# Altium project roach2_project.PrjPCB (part 10 of 13)

## Sheet mgt_breakout.SchDoc: MGT Mezzanine Card Interfaces
size A3; Date: DO NOT USE, RATHER USE PROJ OPTIONS; DrawnBy: DO NOT USE, RATHER USE PROJ OPTIONS; Engineer: DO NOT USE, RATHER USE PROJ OPTIONS; Organization: DO NOT USE, RATHER USE PROJ OPTIONS; DocumentNumber: DO NOT USE, RATHER USE PROJ OPTIONS; Revision: DO NOT USE, RATHER USE PROJ OPTIONS; SheetNumber: 24; SheetTotal: 27; SCH_Sheet_Filename: mgt_breakout.SchDoc; CurrentTime: DO NOT USE, RATHER USE PROJ OPTIONS; Time: DO NOT USE, RATHER USE PROJ OPTIONS; DocumentFullPathAndName: DO NOT USE, RATHER USE PROJ OPTIONS; DocumentName: DO NOT USE, RATHER USE PROJ OPTIONS; ModifiedDate: DO NOT USE, RATHER USE PROJ OPTIONS; ImagePath: DO NOT USE, RATHER USE PROJ OPTIONS
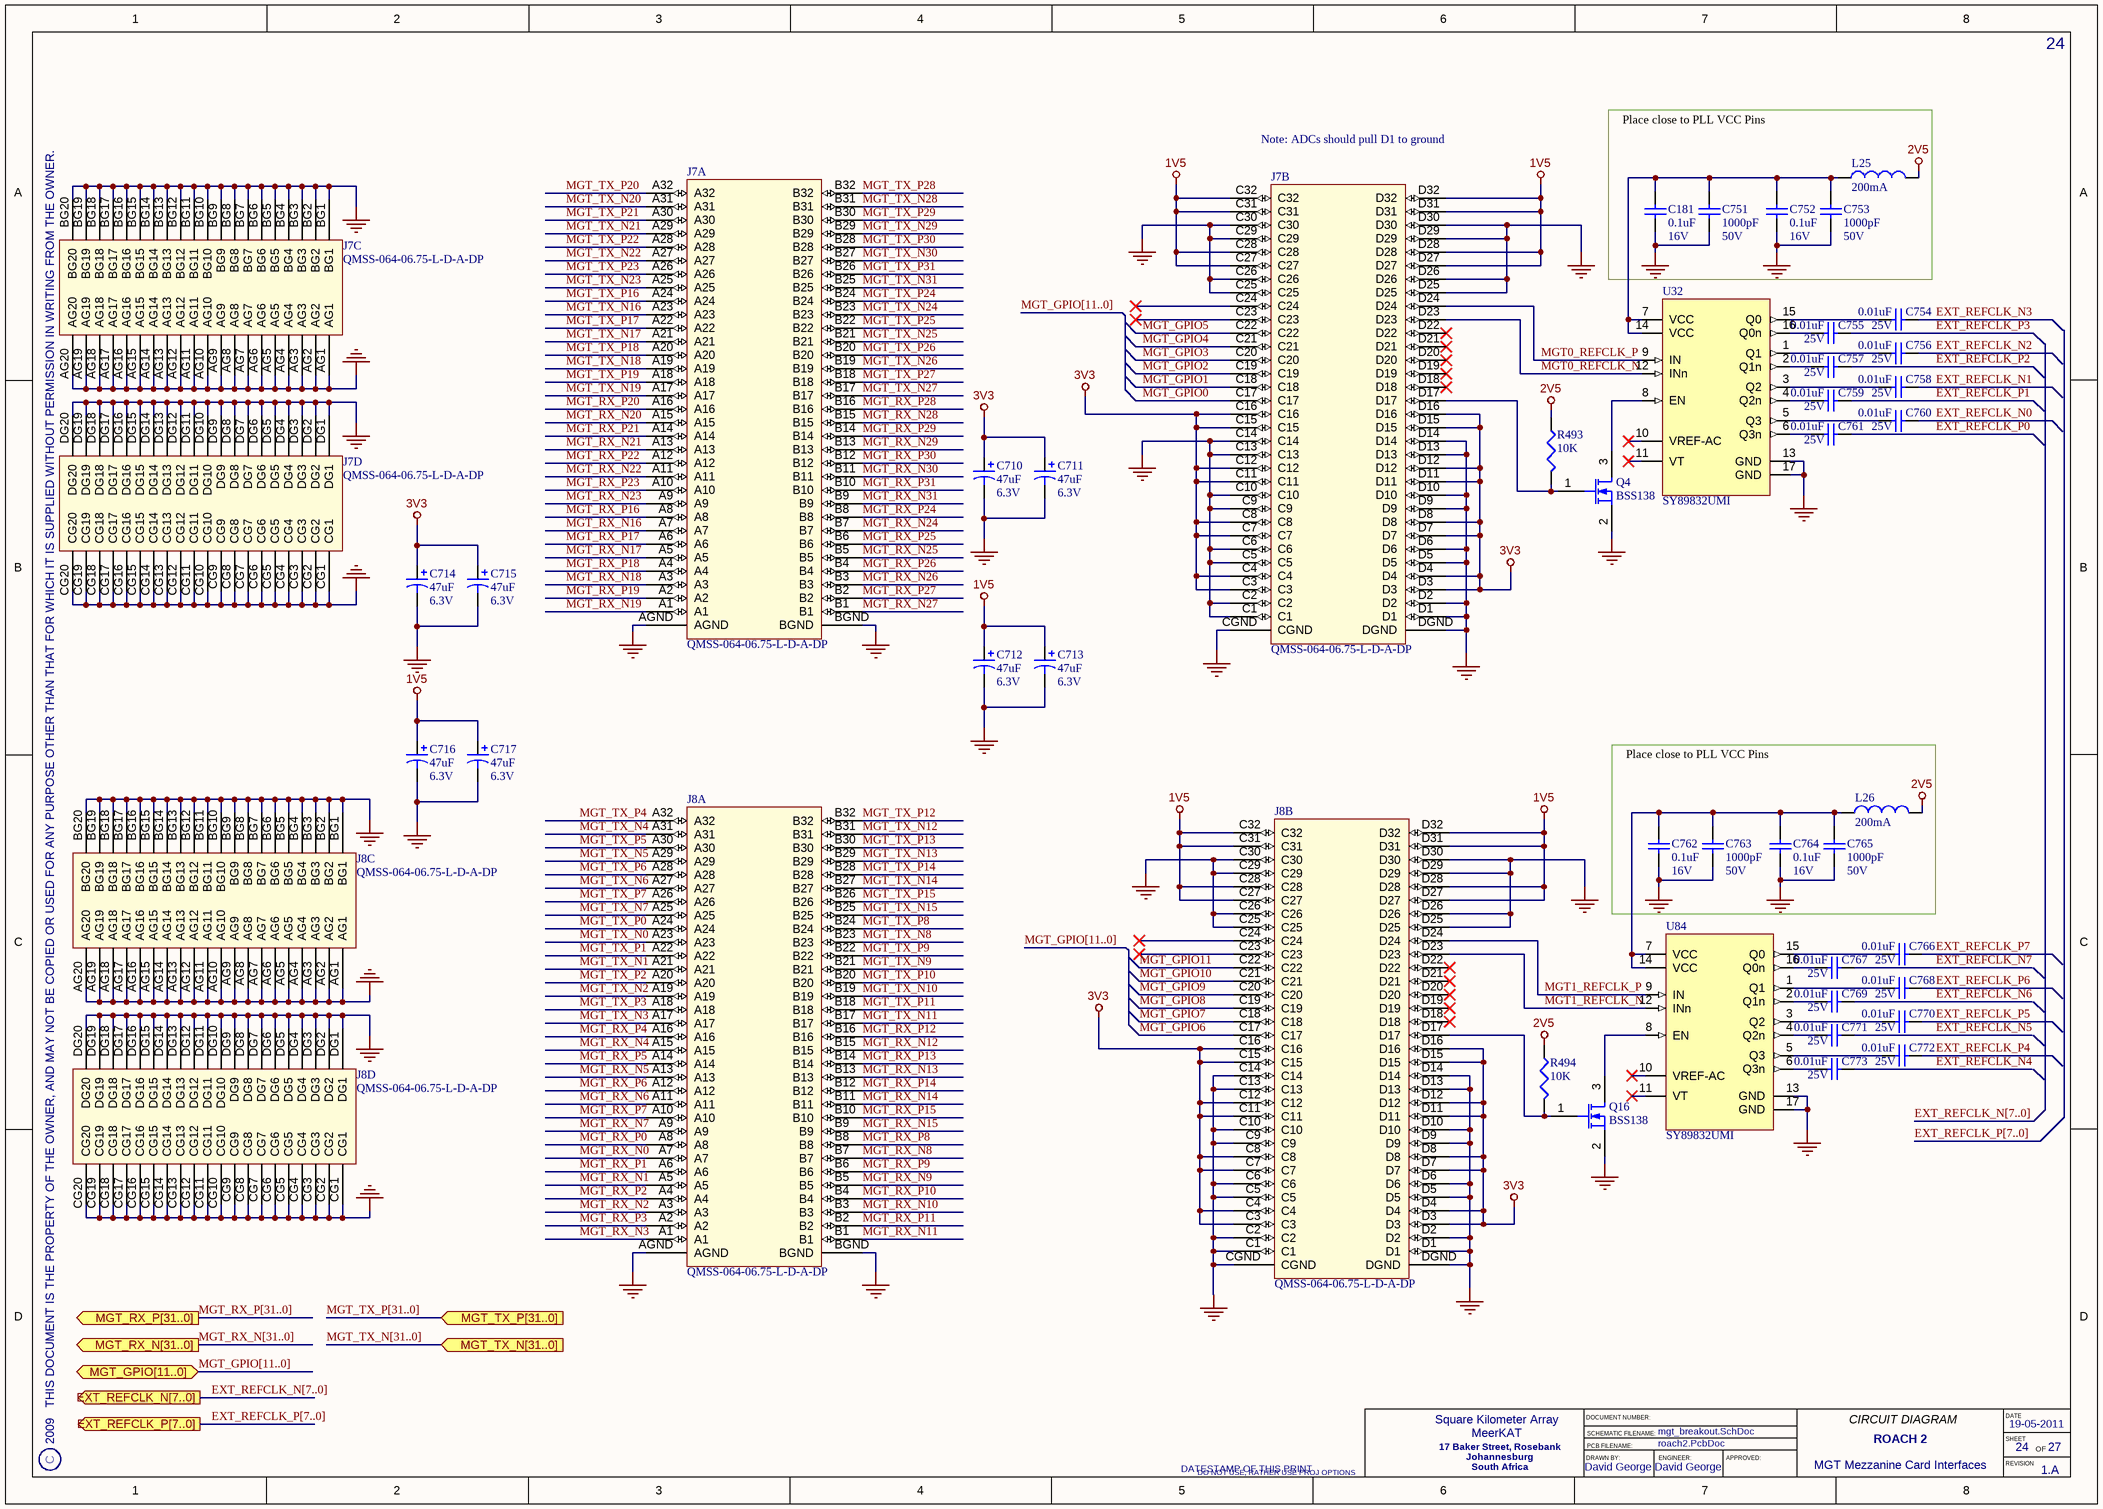
[diagram p20: mgt_breakout.SchDoc]

### Parts
C181  Rating: 16V  [CAPC1005X60L]  (hidden comment: 0.1uF)
C710  Rating: 6.3V  [CAPMP3528X120L]  (hidden comment: 47uF)
C711  Rating: 6.3V  [CAPMP3528X120L]  (hidden comment: 47uF)
C712  Rating: 6.3V  [CAPMP3528X120L]  (hidden comment: 47uF)
C713  Rating: 6.3V  [CAPMP3528X120L]  (hidden comment: 47uF)
C714  Rating: 6.3V  [CAPMP3528X120L]  (hidden comment: 47uF)
C715  Rating: 6.3V  [CAPMP3528X120L]  (hidden comment: 47uF)
C716  Rating: 6.3V  [CAPMP3528X120L]  (hidden comment: 47uF)
C717  Rating: 6.3V  [CAPMP3528X120L]  (hidden comment: 47uF)
C751  Rating: 50V  [CAPC1005X55L]  (hidden comment: 1000pF)
C752  Rating: 16V  [CAPC1005X60L]  (hidden comment: 0.1uF)
C753  Rating: 50V  [CAPC1005X55L]  (hidden comment: 1000pF)
C754  Rating: 25V  [CAPC1005X55L]  (hidden comment: 0.01uF)
C755  Rating: 25V  [CAPC1005X55L]  (hidden comment: 0.01uF)
C756  Rating: 25V  [CAPC1005X55L]  (hidden comment: 0.01uF)
C757  Rating: 25V  [CAPC1005X55L]  (hidden comment: 0.01uF)
C758  Rating: 25V  [CAPC1005X55L]  (hidden comment: 0.01uF)
C759  Rating: 25V  [CAPC1005X55L]  (hidden comment: 0.01uF)
C760  Rating: 25V  [CAPC1005X55L]  (hidden comment: 0.01uF)
C761  Rating: 25V  [CAPC1005X55L]  (hidden comment: 0.01uF)
C762  Rating: 16V  [CAPC1005X60L]  (hidden comment: 0.1uF)
C763  Rating: 50V  [CAPC1005X55L]  (hidden comment: 1000pF)
C764  Rating: 16V  [CAPC1005X60L]  (hidden comment: 0.1uF)
C765  Rating: 50V  [CAPC1005X55L]  (hidden comment: 1000pF)
C766  Rating: 25V  [CAPC1005X55L]  (hidden comment: 0.01uF)
C767  Rating: 25V  [CAPC1005X55L]  (hidden comment: 0.01uF)
C768  Rating: 25V  [CAPC1005X55L]  (hidden comment: 0.01uF)
C769  Rating: 25V  [CAPC1005X55L]  (hidden comment: 0.01uF)
C770  Rating: 25V  [CAPC1005X55L]  (hidden comment: 0.01uF)
C771  Rating: 25V  [CAPC1005X55L]  (hidden comment: 0.01uF)
C772  Rating: 25V  [CAPC1005X55L]  (hidden comment: 0.01uF)
C773  Rating: 25V  [CAPC1005X55L]  (hidden comment: 0.01uF)
J7  PartNum: QMSS-064-06.75-L-D-A-DP  [SAMTEC_QMSS-064-06_75-L-D-A-DP]  (hidden comment: QMSS-064-06_75-L-D-A-DP)  (parts A,B,C,D of 4)
J8  PartNum: QMSS-064-06.75-L-D-A-DP  [SAMTEC_QMSS-064-06_75-L-D-A-DP]  (hidden comment: QMSS-064-06_75-L-D-A-DP)  (parts A,B,C,D of 4)
L25  Rating: 200mA  [INDC2012X130L]  (hidden comment: 600R)
L26  Rating: 200mA  [INDC2012X130L]  (hidden comment: 600R)
Q4  BSS138  [SOT95P245X110-3N]
Q16  BSS138  [SOT95P245X110-3N]
R493  10K  [RESC1005X40L]
R494  10K  [RESC1005X40L]
U32  SY89832UMI  [MLF-16]
U84  SY89832UMI  [MLF-16]

### Ports
EXT_REFCLK_N[7..0] (out), EXT_REFCLK_P[7..0] (out), MGT_GPIO[11..0] (bidir), MGT_RX_N[31..0] (out), MGT_RX_P[31..0] (out), MGT_TX_N[31..0] (in), MGT_TX_P[31..0] (in)

### Nets
1V5: C712.1 C713.1 C716.1 C717.1 J7.C27 J7.C28 J7.C31 J7.C32 J7.D27 J7.D28 J7.D31 J7.D32 J8.C27 J8.C28 J8.C31 J8.C32 J8.D27 J8.D28 J8.D31 J8.D32
2V5: L25.2 L26.2 R493.1 R494.1
3V3: C710.1 C711.1 C714.1 C715.1 J7.C3 J7.C4 J7.C7 J7.C8 J7.C11 J7.C12 J7.C15 J7.C16 J7.D3 J7.D4 J7.D7 J7.D8 J7.D11 J7.D12 J7.D15 J7.D16 J8.C3 J8.C4 J8.C7 J8.C8 J8.C11 J8.C12 J8.C15 J8.C16 J8.D3 J8.D4 J8.D7 J8.D8 J8.D11 J8.D12 J8.D15 J8.D16
GND: C181.1 C710.2 C711.2 C712.2 C713.2 C714.2 C715.2 C716.2 C717.2 C751.1 C752.1 C753.1 C762.1 C763.1 C764.1 C765.1 J7.AG1 J7.AG2 J7.AG3 J7.AG4 J7.AG5 J7.AG6 J7.AG7 J7.AG8 J7.AG9 J7.AG10 J7.AG11 J7.AG12 J7.AG13 J7.AG14 J7.AG15 J7.AG16 J7.AG17 J7.AG18 J7.AG19 J7.AG20 J7.AGND J7.BG1 J7.BG2 J7.BG3 J7.BG4 J7.BG5 J7.BG6 J7.BG7 J7.BG8 J7.BG9 J7.BG10 J7.BG11 J7.BG12 J7.BG13 J7.BG14 J7.BG15 J7.BG16 J7.BG17 J7.BG18 J7.BG19 J7.BG20 J7.BGND J7.C1 J7.C2 J7.C5 J7.C6 J7.C9 J7.C10 J7.C13 J7.C14 J7.C25 J7.C26 J7.C29 J7.C30 J7.CG1 J7.CG2 J7.CG3 J7.CG4 J7.CG5 J7.CG6 J7.CG7 J7.CG8 J7.CG9 J7.CG10 J7.CG11 J7.CG12 J7.CG13 J7.CG14 J7.CG15 J7.CG16 J7.CG17 J7.CG18 J7.CG19 J7.CG20 J7.CGND J7.D1 J7.D2 J7.D5 J7.D6 J7.D9 J7.D10 J7.D13 J7.D14 J7.D25 J7.D26 J7.D29 J7.D30 J7.DG1 J7.DG2 J7.DG3 J7.DG4 J7.DG5 J7.DG6 J7.DG7 J7.DG8 J7.DG9 J7.DG10 J7.DG11 J7.DG12 J7.DG13 J7.DG14 J7.DG15 J7.DG16 J7.DG17 J7.DG18 J7.DG19 J7.DG20 J7.DGND J8.AG1 J8.AG2 J8.AG3 J8.AG4 J8.AG5 J8.AG6 J8.AG7 J8.AG8 J8.AG9 J8.AG10 J8.AG11 J8.AG12 J8.AG13 J8.AG14 J8.AG15 J8.AG16 J8.AG17 J8.AG18 J8.AG19 J8.AG20 J8.AGND J8.BG1 J8.BG2 J8.BG3 J8.BG4 J8.BG5 J8.BG6 J8.BG7 J8.BG8 J8.BG9 J8.BG10 J8.BG11 J8.BG12 J8.BG13 J8.BG14 J8.BG15 J8.BG16 J8.BG17 J8.BG18 J8.BG19 J8.BG20 J8.BGND J8.C1 J8.C2 J8.C5 J8.C6 J8.C9 J8.C10 J8.C13 J8.C14 J8.C25 J8.C26 J8.C29 J8.C30 J8.CG1 J8.CG2 J8.CG3 J8.CG4 J8.CG5 J8.CG6 J8.CG7 J8.CG8 J8.CG9 J8.CG10 J8.CG11 J8.CG12 J8.CG13 J8.CG14 J8.CG15 J8.CG16 J8.CG17 J8.CG18 J8.CG19 J8.CG20 J8.CGND J8.D1 J8.D2 J8.D5 J8.D6 J8.D9 J8.D10 J8.D13 J8.D14 J8.D25 J8.D26 J8.D29 J8.D30 J8.DG1 J8.DG2 J8.DG3 J8.DG4 J8.DG5 J8.DG6 J8.DG7 J8.DG8 J8.DG9 J8.DG10 J8.DG11 J8.DG12 J8.DG13 J8.DG14 J8.DG15 J8.DG16 J8.DG17 J8.DG18 J8.DG19 J8.DG20 J8.DGND Q4.2(S) Q16.2(S) U32.13(GND) U32.17(GND) U84.13(GND) U84.17(GND)
EXT_REFCLK_N0: C760.2
EXT_REFCLK_N1: C758.2
EXT_REFCLK_N2: C756.2
EXT_REFCLK_N3: C754.2
EXT_REFCLK_N4: C773.2
EXT_REFCLK_N5: C771.2
EXT_REFCLK_N6: C769.2
EXT_REFCLK_N7: C767.2
EXT_REFCLK_P0: C761.2
EXT_REFCLK_P1: C759.2
EXT_REFCLK_P2: C757.2
EXT_REFCLK_P3: C755.2
EXT_REFCLK_P4: C772.2
EXT_REFCLK_P5: C770.2
EXT_REFCLK_P6: C768.2
EXT_REFCLK_P7: C766.2
MGT0_REFCLK_N: J7.D23 U32.12(INn)
MGT0_REFCLK_P: J7.D24 U32.9(IN)
MGT1_REFCLK_N: J8.D23 U84.12(INn)
MGT1_REFCLK_P: J8.D24 U84.9(IN)
MGT_GPIO0: J7.C17
MGT_GPIO1: J7.C18
MGT_GPIO2: J7.C19
MGT_GPIO3: J7.C20
MGT_GPIO4: J7.C21
MGT_GPIO5: J7.C22
MGT_GPIO6: J8.C17
MGT_GPIO7: J8.C18
MGT_GPIO8: J8.C19
MGT_GPIO9: J8.C20
MGT_GPIO10: J8.C21
MGT_GPIO11: J8.C22
MGT_RX_N0: J8.A7
MGT_RX_N1: J8.A5
MGT_RX_N2: J8.A3
MGT_RX_N3: J8.A1
MGT_RX_N4: J8.A15
MGT_RX_N5: J8.A13
MGT_RX_N6: J8.A11
MGT_RX_N7: J8.A9
MGT_RX_N8: J8.B7
MGT_RX_N9: J8.B5
MGT_RX_N10: J8.B3
MGT_RX_N11: J8.B1
MGT_RX_N12: J8.B15
MGT_RX_N13: J8.B13
MGT_RX_N14: J8.B11
MGT_RX_N15: J8.B9
MGT_RX_N16: J7.A7
MGT_RX_N17: J7.A5
MGT_RX_N18: J7.A3
MGT_RX_N19: J7.A1
MGT_RX_N20: J7.A15
MGT_RX_N21: J7.A13
MGT_RX_N22: J7.A11
MGT_RX_N23: J7.A9
MGT_RX_N24: J7.B7
MGT_RX_N25: J7.B5
MGT_RX_N26: J7.B3
MGT_RX_N27: J7.B1
MGT_RX_N28: J7.B15
MGT_RX_N29: J7.B13
MGT_RX_N30: J7.B11
MGT_RX_N31: J7.B9
MGT_RX_P0: J8.A8
MGT_RX_P1: J8.A6
MGT_RX_P2: J8.A4
MGT_RX_P3: J8.A2
MGT_RX_P4: J8.A16
MGT_RX_P5: J8.A14
MGT_RX_P6: J8.A12
MGT_RX_P7: J8.A10
MGT_RX_P8: J8.B8
MGT_RX_P9: J8.B6
MGT_RX_P10: J8.B4
MGT_RX_P11: J8.B2
MGT_RX_P12: J8.B16
MGT_RX_P13: J8.B14
MGT_RX_P14: J8.B12
MGT_RX_P15: J8.B10
MGT_RX_P16: J7.A8
MGT_RX_P17: J7.A6
MGT_RX_P18: J7.A4
MGT_RX_P19: J7.A2
MGT_RX_P20: J7.A16
MGT_RX_P21: J7.A14
MGT_RX_P22: J7.A12
MGT_RX_P23: J7.A10
MGT_RX_P24: J7.B8
MGT_RX_P25: J7.B6
MGT_RX_P26: J7.B4
MGT_RX_P27: J7.B2
MGT_RX_P28: J7.B16
MGT_RX_P29: J7.B14
MGT_RX_P30: J7.B12
MGT_RX_P31: J7.B10
MGT_TX_N0: J8.A23
MGT_TX_N1: J8.A21
MGT_TX_N2: J8.A19
MGT_TX_N3: J8.A17
MGT_TX_N4: J8.A31
MGT_TX_N5: J8.A29
MGT_TX_N6: J8.A27
MGT_TX_N7: J8.A25
MGT_TX_N8: J8.B23
MGT_TX_N9: J8.B21
MGT_TX_N10: J8.B19
MGT_TX_N11: J8.B17
MGT_TX_N12: J8.B31
MGT_TX_N13: J8.B29
MGT_TX_N14: J8.B27
MGT_TX_N15: J8.B25
MGT_TX_N16: J7.A23
MGT_TX_N17: J7.A21
MGT_TX_N18: J7.A19
MGT_TX_N19: J7.A17
MGT_TX_N20: J7.A31
MGT_TX_N21: J7.A29
MGT_TX_N22: J7.A27
MGT_TX_N23: J7.A25
MGT_TX_N24: J7.B23
MGT_TX_N25: J7.B21
MGT_TX_N26: J7.B19
MGT_TX_N27: J7.B17
MGT_TX_N28: J7.B31
MGT_TX_N29: J7.B29
MGT_TX_N30: J7.B27
MGT_TX_N31: J7.B25
MGT_TX_P0: J8.A24
MGT_TX_P1: J8.A22
MGT_TX_P2: J8.A20
MGT_TX_P3: J8.A18
MGT_TX_P4: J8.A32
MGT_TX_P5: J8.A30
MGT_TX_P6: J8.A28
MGT_TX_P7: J8.A26
MGT_TX_P8: J8.B24
MGT_TX_P9: J8.B22
MGT_TX_P10: J8.B20
MGT_TX_P11: J8.B18
MGT_TX_P12: J8.B32
MGT_TX_P13: J8.B30
MGT_TX_P14: J8.B28
MGT_TX_P15: J8.B26
MGT_TX_P16: J7.A24
MGT_TX_P17: J7.A22
MGT_TX_P18: J7.A20
MGT_TX_P19: J7.A18
MGT_TX_P20: J7.A32
MGT_TX_P21: J7.A30
MGT_TX_P22: J7.A28
MGT_TX_P23: J7.A26
MGT_TX_P24: J7.B24
MGT_TX_P25: J7.B22
MGT_TX_P26: J7.B20
MGT_TX_P27: J7.B18
MGT_TX_P28: J7.B32
MGT_TX_P29: J7.B30
MGT_TX_P30: J7.B28
MGT_TX_P31: J7.B26
NetC181_2: C181.2 C751.2 C752.2 C753.2 L25.1 U32.7(VCC) U32.14(VCC)
NetC754_1: C754.1 U32.15(Q0)
NetC755_1: C755.1 U32.16(Q0n)
NetC756_1: C756.1 U32.1(Q1)
NetC757_1: C757.1 U32.2(Q1n)
NetC758_1: C758.1 U32.3(Q2)
NetC759_1: C759.1 U32.4(Q2n)
NetC760_1: C760.1 U32.5(Q3)
NetC761_1: C761.1 U32.6(Q3n)
NetC762_2: C762.2 C763.2 C764.2 C765.2 L26.1 U84.7(VCC) U84.14(VCC)
NetC766_1: C766.1 U84.15(Q0)
NetC767_1: C767.1 U84.16(Q0n)
NetC768_1: C768.1 U84.1(Q1)
NetC769_1: C769.1 U84.2(Q1n)
NetC770_1: C770.1 U84.3(Q2)
NetC771_1: C771.1 U84.4(Q2n)
NetC772_1: C772.1 U84.5(Q3)
NetC773_1: C773.1 U84.6(Q3n)
NetJ7_D17: J7.D17 Q4.1(G) R493.2
NetJ8_D17: J8.D17 Q16.1(G) R494.2
NetQ4_3: Q4.3(D) U32.8(EN)
NetQ16_3: Q16.3(D) U84.8(EN)

Not connected (* = marked no-connect by the designer): J7 C23* C24* D18* D19* D20* D21* D22*; J8 C23* C24* D18* D19* D20* D21* D22*; U32 10(VREF-AC)* 11(VT)*; U84 10(VREF-AC)* 11(VT)*

### Buses and harness runs
bus EXT_REFCLK_N[7..0]
bus EXT_REFCLK_N[7..0] = port EXT_REFCLK_N[7..0]
bus EXT_REFCLK_P[7..0]
bus EXT_REFCLK_P[7..0] = port EXT_REFCLK_P[7..0]
bus MGT_GPIO[11..0]
bus MGT_GPIO[11..0] = port MGT_GPIO[11..0]
bus MGT_RX_N[31..0] = port MGT_RX_N[31..0]
bus MGT_RX_P[31..0] = port MGT_RX_P[31..0]
bus MGT_TX_N[31..0] = port MGT_TX_N[31..0]
bus MGT_TX_P[31..0] = port MGT_TX_P[31..0]

### Notes on the sheet
- (near J7) Note: ADCs should pull D1 to ground
- Place close to PLL VCC Pins
- 2009   THIS DOCUMENT IS THE PROPERTY OF THE OWNER, AND MAY NOT BE COPIED OR USED FOR ANY PURPOSE OTHER THAN THAT FOR WHICH IT IS SUPPLIED WITHOUT PERMISSION IN WRITING FROM THE OWNER.
- C
- DATESTAMP OF THIS PRINT
- DRAWN BY:
- DOCUMENT NUMBER:
- SCHEMATIC FILENAME:
- PCB FILENAME:
- ENGINEER:
- APPROVED:
- CIRCUIT DIAGRAM
- DATE
- SHEET
- REVISION
- OF

### Library data of the parts
C181 C752 C762 C764 = CAP-CER-1: 0.1uF, Ceramic Capacitor; Manufacturer: VENKEL; PartNum: C0402X7R160-104KN; Tolerance: 10%; Dielectric: X7R; POD number: CAP-CER-1; Value: 0.1uF; RoHS: Y; Sort Value: 0.1; Category: Capacitors; Subcategory: Ceramic
C710-C717 = CAP-TAN-1: 47uF, Conductive Polymer Chip Capacitor; Manufacturer: KEMET; PartNum: T520T476M006ATE070; Tolerance: 20%; ESR: 0.07; POD number: CAP-TAN-1; Value: 47uF; RoHS: Y; Sort Value: 47; Category: Capacitors; Subcategory: Tantalum
C751 C753 C763 C765 = CAP-CER-4: 1000pF, Ceramic Capacitor; Manufacturer: MURATA; PartNum: GRM155R61H102KA01D; Tolerance: 10%; Dielectric: X5R; POD number: CAP-CER-4; Value: 1000pF; RoHS: Y; Sort Value: 0.0001; Category: Capacitors; Subcategory: Ceramic
C754-C761 C766-C773 = CAP-CER-6: 0.01uF, Ceramic Capacitor; Manufacturer: MURATA; PartNum: GRM155R71E103KA01D; Tolerance: 10%; Dielectric: X7R; POD number: CAP-CER-6; Value: 0.01uF; RoHS: Y; Sort Value: 0.01; Category: Capacitors; Subcategory: Ceramic
J7 J8 = CONN-PCB-23: Shielded, 64-Differential Pair, Rugged High-Speed Terminal Strip, 0.635mm Pitch,; POD number: CONN-PCB-23
L25 L26 = IND-FB-0: 600 Ohm, Chip Ferrite Bead; Manufacturer: Murata; PartNum: BLM21BD601SN1; DC Res: 0.35R; Tolerance: 25%; POD number: IND-FB-0; RoHS: Y; Value: 600R; Sort Value: 600; Category: Inductors; Subcategory: FerriteBead
Q4 Q16 = TRANS-NFET-0: N-Channel Logic Level Enhancement Mode Field Effect Transistor; Manufacturer: Fairchild Semiconductor; Rating: 0.22A; POD number: TRANS-NFET-0; PartNum: BSS138; RoHS: Y; Category: TRANS; Subcategory: NFET
R493 R494 = RES-TF-5: 10K, 1.1mm x 0.5mm, Thick Film Resistor; Manufacturer: ROYALOHM; PartNum: 0402WGJ0103T1E; Tolerance: 5%; Rating: 0.0625W; POD number: RES-TF-5; Value: 10K; Sort Value: 10000; Category: Resistors; Subcategory: ThickFilm; HelpURL: *.pdf
U32 U84 = IC-LOG-14: 2.5 C Ultra-precision 1:4 LVDS Fanout Buffer/Translator with Interal Termination; Manufacturer: Micrel; POD number: IC-LOG-14; PartNum: SY89832UMI; RoHS: Y; Category: IC; Subcategory: Logic

## Sheet v6_net.SchDoc: Virtex-6 Gigabit Ethernet
size A3; Date: DO NOT USE, RATHER USE PROJ OPTIONS; DrawnBy: DO NOT USE, RATHER USE PROJ OPTIONS; Engineer: DO NOT USE, RATHER USE PROJ OPTIONS; Organization: DO NOT USE, RATHER USE PROJ OPTIONS; DocumentNumber: DO NOT USE, RATHER USE PROJ OPTIONS; Revision: DO NOT USE, RATHER USE PROJ OPTIONS; SheetNumber: 23; SheetTotal: 27; SCH_Sheet_Filename: v6_net.SchDoc; CurrentTime: DO NOT USE, RATHER USE PROJ OPTIONS; Time: DO NOT USE, RATHER USE PROJ OPTIONS; DocumentFullPathAndName: DO NOT USE, RATHER USE PROJ OPTIONS; DocumentName: DO NOT USE, RATHER USE PROJ OPTIONS; ModifiedDate: DO NOT USE, RATHER USE PROJ OPTIONS; ImagePath: DO NOT USE, RATHER USE PROJ OPTIONS
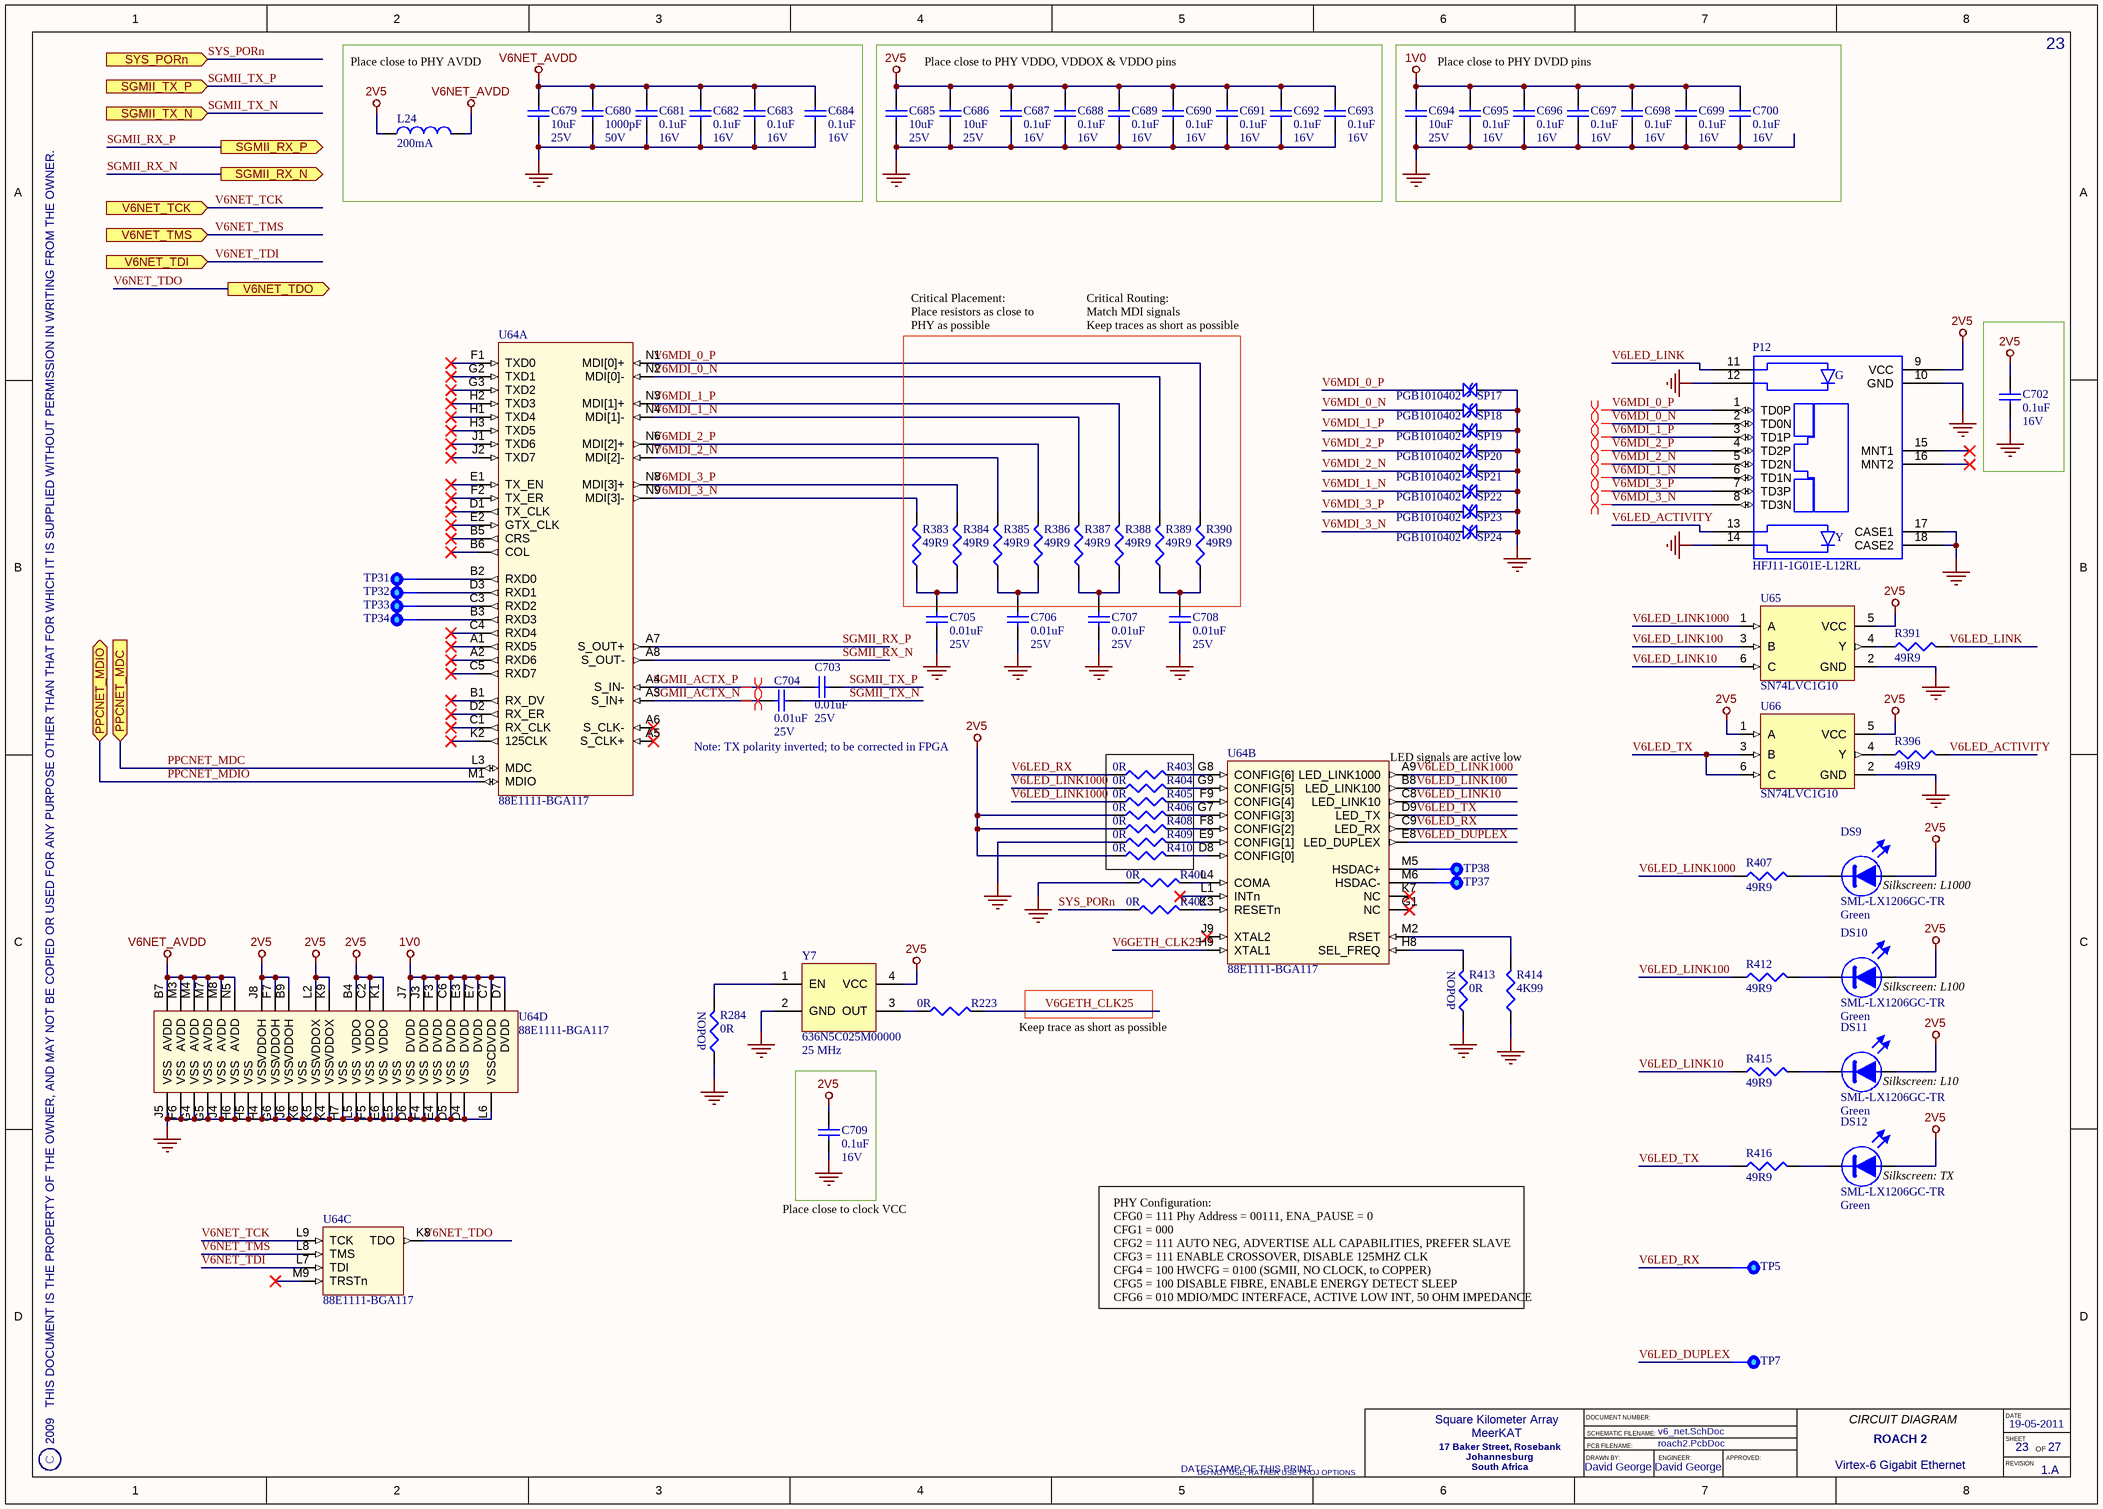
[diagram p21: v6_net.SchDoc]

### Parts
C679  Rating: 25V  [CAPC3225X200L]  (hidden comment: 10uF)
C680  Rating: 50V  [CAPC1005X55L]  (hidden comment: 1000pF)
C681  Rating: 16V  [CAPC1005X60L]  (hidden comment: 0.1uF)
C682  Rating: 16V  [CAPC1005X60L]  (hidden comment: 0.1uF)
C683  Rating: 16V  [CAPC1005X60L]  (hidden comment: 0.1uF)
C684  Rating: 16V  [CAPC1005X60L]  (hidden comment: 0.1uF)
C685  Rating: 25V  [CAPC3225X200L]  (hidden comment: 10uF)
C686  Rating: 25V  [CAPC3225X200L]  (hidden comment: 10uF)
C687  Rating: 16V  [CAPC1005X60L]  (hidden comment: 0.1uF)
C688  Rating: 16V  [CAPC1005X60L]  (hidden comment: 0.1uF)
C689  Rating: 16V  [CAPC1005X60L]  (hidden comment: 0.1uF)
C690  Rating: 16V  [CAPC1005X60L]  (hidden comment: 0.1uF)
C691  Rating: 16V  [CAPC1005X60L]  (hidden comment: 0.1uF)
C692  Rating: 16V  [CAPC1005X60L]  (hidden comment: 0.1uF)
C693  Rating: 16V  [CAPC1005X60L]  (hidden comment: 0.1uF)
C694  Rating: 25V  [CAPC3225X200L]  (hidden comment: 10uF)
C695  Rating: 16V  [CAPC1005X60L]  (hidden comment: 0.1uF)
C696  Rating: 16V  [CAPC1005X60L]  (hidden comment: 0.1uF)
C697  Rating: 16V  [CAPC1005X60L]  (hidden comment: 0.1uF)
C698  Rating: 16V  [CAPC1005X60L]  (hidden comment: 0.1uF)
C699  Rating: 16V  [CAPC1005X60L]  (hidden comment: 0.1uF)
C700  Rating: 16V  [CAPC1005X60L]  (hidden comment: 0.1uF)
C702  Rating: 16V  [CAPC1005X60L]  (hidden comment: 0.1uF)
C703  Rating: 25V  [CAPC1005X55L]  (hidden comment: 0.01uF)
C704  Rating: 25V  [CAPC1005X55L]  (hidden comment: 0.01uF)
C705  Rating: 25V  [CAPC1005X55L]  (hidden comment: 0.01uF)
C706  Rating: 25V  [CAPC1005X55L]  (hidden comment: 0.01uF)
C707  Rating: 25V  [CAPC1005X55L]  (hidden comment: 0.01uF)
C708  Rating: 25V  [CAPC1005X55L]  (hidden comment: 0.01uF)
C709  Rating: 16V  [CAPC1005X60L]  (hidden comment: 0.1uF)
DS9  SML-LX1206GC-TR  Colour: Green  [LEDC3216X120N]
DS10  SML-LX1206GC-TR  Colour: Green  [LEDC3216X120N]
DS11  SML-LX1206GC-TR  Colour: Green  [LEDC3216X120N]
DS12  SML-LX1206GC-TR  Colour: Green  [LEDC3216X120N]
L24  Rating: 200mA  [INDC2012X130L]  (hidden comment: 600R)
P12  HFJ11-1G01E-L12RL  [HALO_HFJ11-1G02E-L55]
R223  0R  [RESC1005X40L]
R284  0R  [RESC1005X40L]
R383  49R9  [RESC1005X40L]
R384  49R9  [RESC1005X40L]
R385  49R9  [RESC1005X40L]
R386  49R9  [RESC1005X40L]
R387  49R9  [RESC1005X40L]
R388  49R9  [RESC1005X40L]
R389  49R9  [RESC1005X40L]
R390  49R9  [RESC1005X40L]
R391  49R9  [RESC1005X40L]
R396  49R9  [RESC1005X40L]
R400  0R  [RESC1005X40L]
R402  0R  [RESC1005X40L]
R403  0R  [RESC1005X40L]
R404  0R  [RESC1005X40L]
R405  0R  [RESC1005X40L]
R406  0R  [RESC1005X40L]
R407  49R9  [RESC1005X40L]
R408  0R  [RESC1005X40L]
R409  0R  [RESC1005X40L]
R410  0R  [RESC1005X40L]
R412  49R9  [RESC1005X40L]
R413  0R  [RESC1005X40L]
R414  4K99  [RESC1005X40L]
R415  49R9  [RESC1005X40L]
R416  49R9  [RESC1005X40L]
SP17  PGB1010402  [PGB1010402]
SP18  PGB1010402  [PGB1010402]
SP19  PGB1010402  [PGB1010402]
SP20  PGB1010402  [PGB1010402]
SP21  PGB1010402  [PGB1010402]
SP22  PGB1010402  [PGB1010402]
SP23  PGB1010402  [PGB1010402]
SP24  PGB1010402  [PGB1010402]
TP5  Testpoint  [TP100]  (value not drawn)  (no BOM)
TP7  Testpoint  [TP100]  (value not drawn)  (no BOM)
TP31  Testpoint  [TP100]  (value not drawn)  (no BOM)
TP32  Testpoint  [TP100]  (value not drawn)  (no BOM)
TP33  Testpoint  [TP100]  (value not drawn)  (no BOM)
TP34  Testpoint  [TP100]  (value not drawn)  (no BOM)
TP37  Testpoint  [TP100]  (value not drawn)  (no BOM)
TP38  Testpoint  [TP100]  (value not drawn)  (no BOM)
U64  88E1111-BGA117  [BGA117C100P13X9_1400X1000X154]  (parts A,B,C,D of 4)
U65  SN74LVC1G10  [SOT23-6]
U66  SN74LVC1G10  [SOT23-6]
Y7  Frequency: 25 MHz  [636XXXXXXMXXXXX]  (hidden comment: 636N5C025M00000)

### Ports
PPCNET_MDC (in), PPCNET_MDIO (bidir), SGMII_RX_N (out), SGMII_RX_P (out), SGMII_TX_N (in), SGMII_TX_P (in), SYS_PORn (in), V6NET_TCK (in), V6NET_TDI (in), V6NET_TDO (out), V6NET_TMS (in)

### Nets
1V0: C694.2 C695.2 C696.2 C697.2 C698.2 C699.2 C700.2 U64.C6(DVDD) U64.C7(DVDD) U64.D7(DVDD) U64.E3(DVDD) U64.E7(DVDD) U64.F3(DVDD) U64.J3(DVDD) U64.J7(DVDD)
2V5: C685.2 C686.2 C687.2 C688.2 C689.2 C690.2 C691.2 C692.2 C693.2 C702.2 C709.2 DS9.2(A) DS10.2(A) DS11.2(A) DS12.2(A) L24.1 P12.9(VCC) R406.1 R408.1 R410.1 U64.B4(VDDO) U64.B9(VDDOH) U64.C2(VDDO) U64.F7(VDDOH) U64.J8(VDDOH) U64.K1(VDDO) U64.K9(VDDOX) U64.L2(VDDOX) U65.5(VCC) U66.1(A) U66.5(VCC) Y7.4(VCC)
GND: C679.1 C680.1 C681.1 C682.1 C683.1 C684.1 C685.1 C686.1 C687.1 C688.1 C689.1 C690.1 C691.1 C692.1 C693.1 C694.1 C695.1 C696.1 C697.1 C698.1 C699.1 C700.1 C702.1 C705.2 C706.2 C707.2 C708.2 C709.1 P12.10(GND) P12.12(R1_YA_GC) P12.14(L1_YA_GC) P12.17(CASE1) P12.18(CASE2) R284.1 R400.1 R409.1 R413.1 R414.1 SP17.1(A) SP18.1(A) SP19.1(A) SP20.1(A) SP21.1(A) SP22.1(A) SP23.1(A) SP24.1(A) U64.D4(VSS) U64.D5(VSS) U64.D6(VSS) U64.E4(VSS) U64.E5(VSS) U64.E6(VSS) U64.F4(VSS) U64.F5(VSS) U64.F6(VSS) U64.G4(VSS) U64.G5(VSS) U64.G6(VSS) U64.H4(VSS) U64.H5(VSS) U64.H6(VSS) U64.H7(VSS) U64.J4(VSS) U64.J5(VSS) U64.J6(VSS) U64.K4(VSS) U64.K5(VSS) U64.K6(VSS) U64.L5(VSS) U64.L6(VSSC) U65.2(GND) U66.2(GND) Y7.2(GND)
V6NET_AVDD: C679.2 C680.2 C681.2 C682.2 C683.2 C684.2 L24.2 U64.B7(AVDD) U64.M3(AVDD) U64.M4(AVDD) U64.M7(AVDD) U64.M8(AVDD) U64.N5(AVDD)
PPCNET_MDC: U64.L3(MDC) ; port PPCNET_MDC
PPCNET_MDIO: U64.M1(MDIO) ; port PPCNET_MDIO
SGMII_ACTX_N: C704.2 U64.A3(S_IN+)
SGMII_ACTX_P: C703.2 U64.A4(S_IN-)
SGMII_RX_N: U64.A8(S_OUT-) ; port SGMII_RX_N
SGMII_RX_P: U64.A7(S_OUT+) ; port SGMII_RX_P
SGMII_TX_N: C704.1 ; port SGMII_TX_N
SGMII_TX_P: C703.1 ; port SGMII_TX_P
SYS_PORn: R402.1 ; port SYS_PORn
V6GETH_CLK25: R223.2 U64.H9(XTAL1)
V6LED_ACTIVITY: P12.13(L1_YC_GA) R396.2
V6LED_DUPLEX: TP7.1 U64.E8(LED_DUPLEX)
V6LED_LINK: P12.11(R1_YC_GA) R391.2
V6LED_LINK10: R415.1 U64.C8(LED_LINK10) U65.6(C)
V6LED_LINK100: R412.1 U64.B8(LED_LINK100) U65.3(B)
V6LED_LINK1000: R404.1 R405.1 R407.1 U64.A9(LED_LINK1000) U65.1(A)
V6LED_RX: R403.1 TP5.1 U64.C9(LED_RX)
V6LED_TX: R416.1 U64.D9(LED_TX) U66.3(B) U66.6(C)
V6MDI_0_N: P12.2(TD0N) R389.2 SP18.2(B) U64.N2(MDI[0]-)
V6MDI_0_P: P12.1(TD0P) R390.2 SP17.2(B) U64.N1(MDI[0]+)
V6MDI_1_N: P12.6(TD1N) R387.2 SP22.2(B) U64.N4(MDI[1]-)
V6MDI_1_P: P12.3(TD1P) R388.2 SP19.2(B) U64.N3(MDI[1]+)
V6MDI_2_N: P12.5(TD2N) R385.2 SP21.2(B) U64.N7(MDI[2]-)
V6MDI_2_P: P12.4(TD2P) R386.2 SP20.2(B) U64.N6(MDI[2]+)
V6MDI_3_N: P12.8(TD3N) R383.2 SP24.2(B) U64.N9(MDI[3]-)
V6MDI_3_P: P12.7(TD3P) R384.2 SP23.2(B) U64.N8(MDI[3]+)
V6NET_TCK: U64.L9(TCK) ; port V6NET_TCK
V6NET_TDI: U64.L7(TDI) ; port V6NET_TDI
V6NET_TDO: U64.K8(TDO) ; port V6NET_TDO
V6NET_TMS: U64.L8(TMS) ; port V6NET_TMS
NetC705_1: C705.1 R383.1 R384.1
NetC706_1: C706.1 R385.1 R386.1
NetC707_1: C707.1 R387.1 R388.1
NetC708_1: C708.1 R389.1 R390.1
NetDS9_1: DS9.1(K) R407.2
NetDS10_1: DS10.1(K) R412.2
NetDS11_1: DS11.1(K) R415.2
NetDS12_1: DS12.1(K) R416.2
NetR223_1: R223.1 Y7.3(OUT)
NetR284_2: R284.2 Y7.1(EN)
NetR391_1: R391.1 U65.4(Y)
NetR396_1: R396.1 U66.4(Y)
NetR400_2: R400.2 U64.L4(COMA)
NetR402_2: R402.2 U64.K3(RESETn)
NetR403_2: R403.2 U64.G8(CONFIG[6])
NetR404_2: R404.2 U64.G9(CONFIG[5])
NetR405_2: R405.2 U64.F9(CONFIG[4])
NetR406_2: R406.2 U64.G7(CONFIG[3])
NetR408_2: R408.2 U64.F8(CONFIG[2])
NetR409_2: R409.2 U64.E9(CONFIG[1])
NetR410_2: R410.2 U64.D8(CONFIG[0])
NetR413_2: R413.2 U64.H8(SEL_FREQ)
NetR414_2: R414.2 U64.M2(RSET)
NetTP31_1: TP31.1 U64.B2(RXD0)
NetTP32_1: TP32.1 U64.D3(RXD1)
NetTP33_1: TP33.1 U64.C3(RXD2)
NetTP34_1: TP34.1 U64.B3(RXD3)
NetTP37_1: TP37.1 U64.M6(HSDAC-)
NetTP38_1: TP38.1 U64.M5(HSDAC+)

Not connected (* = marked no-connect by the designer): P12 15(MNT1)* 16(MNT2)*; U64 A1(RXD5)* A2(RXD6)* A5(S_CLK+)* A6(S_CLK-)* B1(RX_DV)* B5(CRS)* B6(COL)* C1(RX_CLK)* C4(RXD4)* C5(RXD7)* D1(TX_CLK)* D2(RX_ER)* E1(TX_EN)* E2(GTX_CLK)* F1(TXD0)* F2(TX_ER)* G1(NC)* G2(TXD1)* G3(TXD2)* H1(TXD4)* H2(TXD3)* H3(TXD5)* J1(TXD6)* J2(TXD7)* J9(XTAL2)* K2(125CLK)* K7(NC)* L1(INTn)* M9(TRSTn)*

### Layout directives
differential pair: SGMII_ACTX_N, SGMII_ACTX_P, V6MDI_0_N, V6MDI_0_P, V6MDI_1_N, V6MDI_1_P, V6MDI_2_N, V6MDI_2_P, V6MDI_3_N, V6MDI_3_P

### Notes on the sheet
- Place close to PHY AVDD
- Place close to PHY VDDO, VDDOX & VDDO pins
- Place close to PHY DVDD pins
- Critical Placement:
  Place resistors as close to
  PHY as possible
- Critical Routing:
  Match MDI signals
  Keep traces as short as possible
- Note: TX polarity inverted; to be corrected in FPGA
- (near U64) LED signals are active low
- (near DS9) Silkscreen: L1000
- (near R413) NOPOP
- (near DS10) Silkscreen: L100
- (near R284) NOPOP
- (near R223) Keep trace as short as possible
- (near DS11) Silkscreen: L10
- (near DS12) Silkscreen: TX
- Place close to clock VCC
- PHY Configuration:
  CFG0 = 111 Phy Address = 00111, ENA_PAUSE = 0
  CFG1 = 000
  CFG2 = 111 AUTO NEG, ADVERTISE ALL CAPABILITIES, PREFER SLAVE
  CFG3 = 111 ENABLE CROSSOVER, DISABLE 125MHZ CLK
  CFG4 = 100 HWCFG = 0100 (SGMII, NO CLOCK, to COPPER)
  CFG5 = 100 DISABLE FIBRE, ENABLE ENERGY DETECT SLEEP
  CFG6 = 010 MDIO/MDC INTERFACE, ACTIVE LOW INT, 50 OHM IMPEDANCE
- 2009   THIS DOCUMENT IS THE PROPERTY OF THE OWNER, AND MAY NOT BE COPIED OR USED FOR ANY PURPOSE OTHER THAN THAT FOR WHICH IT IS SUPPLIED WITHOUT PERMISSION IN WRITING FROM THE OWNER.
- C
- DATESTAMP OF THIS PRINT
- DRAWN BY:
- DOCUMENT NUMBER:
- SCHEMATIC FILENAME:
- PCB FILENAME:
- ENGINEER:
- APPROVED:
- CIRCUIT DIAGRAM
- DATE
- SHEET
- REVISION
- OF
- (in symbol CONN-PCB-4) G

### Library data of the parts
C679 C685 C686 C694 = CAP-CER-5: 10uF, Ceramic Capacitor; Manufacturer: MURATA; PartNum: GRM32DR61E106KA12L; Tolerance: 10%; Dielectric: X5R; POD number: CAP-CER-5; Value: 10uF; RoHS: Y; Sort Value: 100; Category: Capacitors; Subcategory: Ceramic
C680 = CAP-CER-4: as C751 on sheet mgt_breakout; POD number: CAP-CER-4; Value: 1000pF; RoHS: Y; Sort Value: 0.0001; Category: Capacitors; Subcategory: Ceramic
C681-C684 C687-C693 C695-C700 C702 C709 = CAP-CER-1: as C181 on sheet mgt_breakout; POD number: CAP-CER-1; Value: 0.1uF; RoHS: Y; Sort Value: 0.1; Category: Capacitors; Subcategory: Ceramic
C703-C708 = CAP-CER-6: as C754-C761 on sheet mgt_breakout; POD number: CAP-CER-6; Value: 0.01uF; RoHS: Y; Sort Value: 0.01; Category: Capacitors; Subcategory: Ceramic
DS9-DS12 = OPTO-LED-0: Green, Surface mount, LED, 1206; Manufacturer: LUMEX; Vdrop: 2.2V; Rating: 20mA; POD number: OPTO-LED-0; PartNum: SML-LX1206GC-TR; RoHS: Y; Category: OPTO; Subcategory: LED
L24 = IND-FB-0: as L25 on sheet mgt_breakout; POD number: IND-FB-0; RoHS: Y; Value: 600R; Sort Value: 600; Category: Inductors; Subcategory: FerriteBead
P12 = CONN-PCB-4: RJ45 with Integrated magnetic and dual LEDs; Manufacturer: HALO; POD number: CONN-PCB-4; PartNum: HFJ11-1G01E-L12RL; RoHS: Y; Category: CONN; Subcategory: PCB
R223 R284 R400 R402-R406 R408-R410 R413 = RES-TF-0: 0R, 1.1mm x 0.5mm, Thick Film Resistor; Manufacturer: ROYALOHM; PartNum: 0402WG00000T1E; Tolerance: 0%; Rating: 0.0625W; POD number: RES-TF-0; Value: 0R; Sort Value: 0; Category: Resistors; Subcategory: ThickFilm; HelpURL: *.pdf
R383-R391 R396 R407 R412 R415 R416 = RES-TF-10: 49R9, 1.1mm x 0.5mm, Thick Film Resistor; Manufacturer: ROYALOHM; PartNum: 0402WGF499JT1E; Tolerance: 1%; Rating: 0.0625W; POD number: RES-TF-10; Value: 49R9; Sort Value: 49.9; Category: Resistors; Subcategory: ThickFilm; HelpURL: *.pdf
R414 = RES-TF-13: 4K99, 1.1mm x 0.5mm, Thick Film Resistor; Manufacturer: ROYALOHM; PartNum: 0402WGF4991T1E; Tolerance: 1%; Rating: 0.0625W; POD number: RES-TF-13; Value: 4K99; Sort Value: 4990; Category: Resistors; Subcategory: ThickFilm; HelpURL: *.pdf
SP17-SP24 = ELMECH-ESD-3: Surface Mount Polymeric ESD Suppressor in an 0402 package; POD number: ELMECH-ESD-3; PartNum: PGB1010402
TP5 TP7 TP31-TP34 TP37 TP38 = ELMECH-TP-0: 1mm Diameter, through-hole, Circular Test-point; POD number: ELMECH-TP-0; RoHS: Y; Category: ELMECH; Subcategory: Test Points
U64 = IC-PHY-1: Integrated 10/100/1000 Ultra Gigabit Ethernet Transceiver; Manufacturer: Marvell; PartNum: 88E1111-XX-BAB1C000; POD number: IC-PHY-1; RoHS: Y; Category: IC; Subcategory: Network PHY
U65 U66 = IC-LOG-3: Single 3-input Positive-NAND gate; Manufacturer: Texas Instruments; POD number: IC-LOG-3; PartNum: SN74LVC1G10; RoHS: Y; Category: IC; Subcategory: Logic
Y7 = RESN-CLK-5: 25.00 MHz, 2V5, CTS 636 clock oscillator; Stability: 50 PPM; POD number: RESN-CLK-5; PartNum: 636N5C025M00000; Manufacturer: CTS; RoHS: Y; Category: RESN; Subcategory: Clock Oscillators

## Sheet ppc_ddr2_0.SchDoc: PowerPC DDR2 Interface
size A3; Date: DO NOT USE, RATHER USE PROJ OPTIONS; DrawnBy: DO NOT USE, RATHER USE PROJ OPTIONS; Engineer: DO NOT USE, RATHER USE PROJ OPTIONS; Organization: DO NOT USE, RATHER USE PROJ OPTIONS; DocumentNumber: DO NOT USE, RATHER USE PROJ OPTIONS; Revision: DO NOT USE, RATHER USE PROJ OPTIONS; SheetNumber: 8; SheetTotal: 27; SCH_Sheet_Filename: ppc_ddr2_0.SchDoc; CurrentTime: DO NOT USE, RATHER USE PROJ OPTIONS; Time: DO NOT USE, RATHER USE PROJ OPTIONS; DocumentFullPathAndName: DO NOT USE, RATHER USE PROJ OPTIONS; DocumentName: DO NOT USE, RATHER USE PROJ OPTIONS; ModifiedDate: DO NOT USE, RATHER USE PROJ OPTIONS; ImagePath: DO NOT USE, RATHER USE PROJ OPTIONS
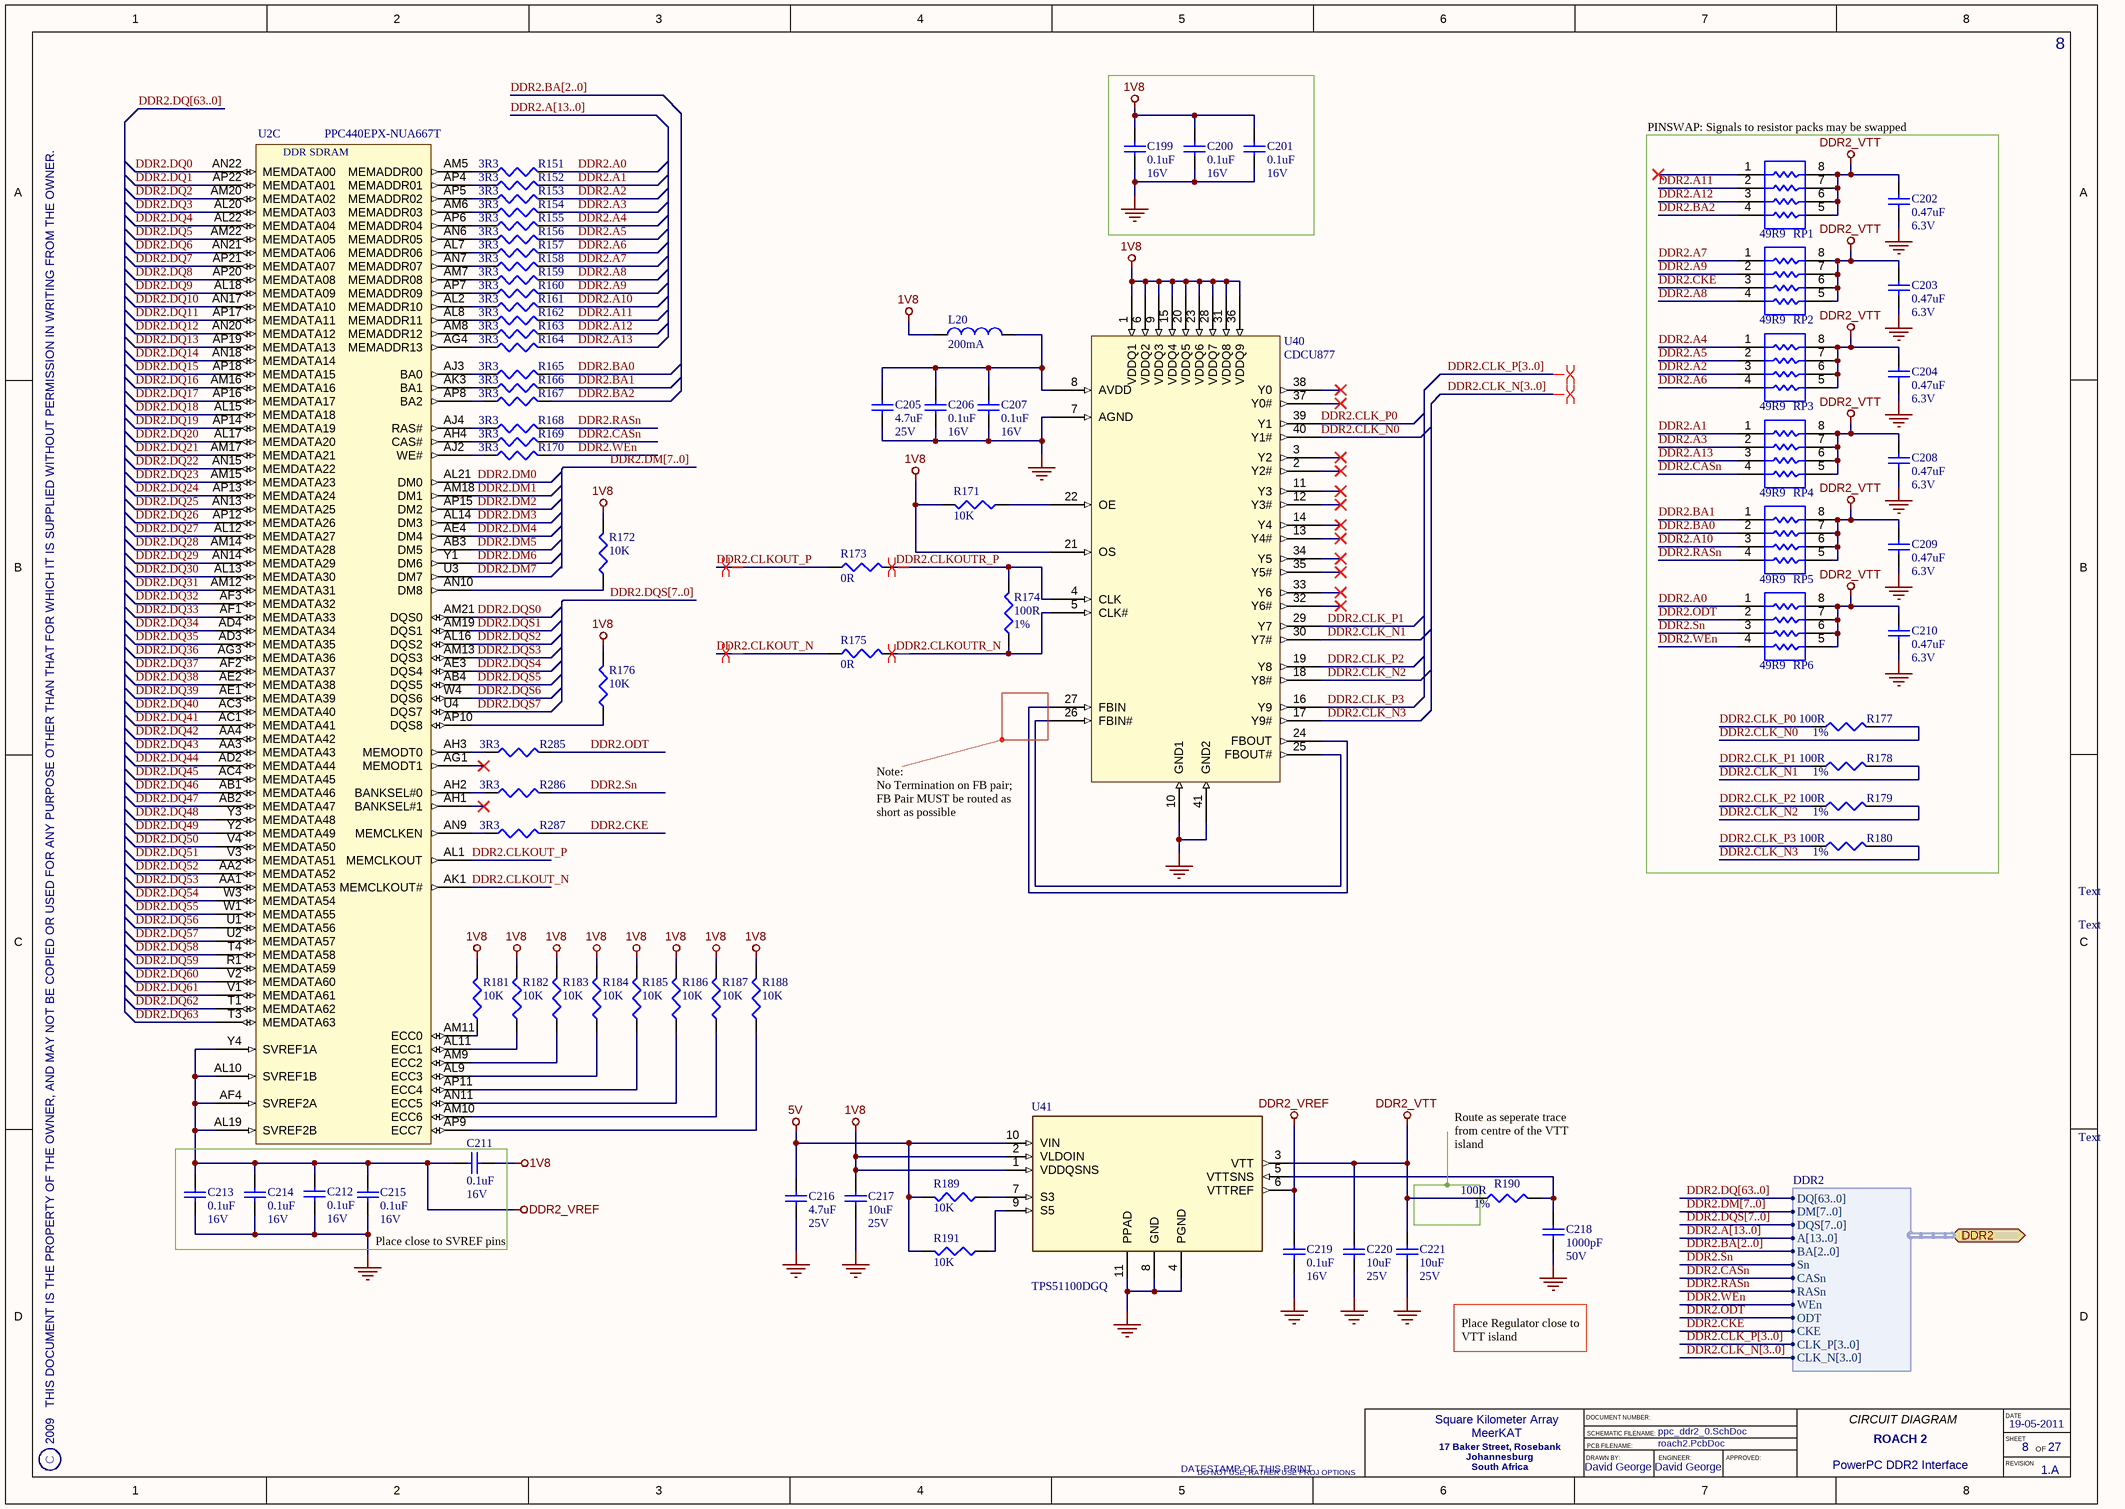
[diagram p22: ppc_ddr2_0.SchDoc]

### Parts
C199  Rating: 16V  [CAPC1005X60L]  (hidden comment: 0.1uF)
C200  Rating: 16V  [CAPC1005X60L]  (hidden comment: 0.1uF)
C201  Rating: 16V  [CAPC1005X60L]  (hidden comment: 0.1uF)
C202  Rating: 6.3V  [CAPC1005X55L]  (hidden comment: 0.47uF)
C203  Rating: 6.3V  [CAPC1005X55L]  (hidden comment: 0.47uF)
C204  Rating: 6.3V  [CAPC1005X55L]  (hidden comment: 0.47uF)
C205  Rating: 25V  [CAPC2012X127L]  (hidden comment: 4.7uF)
C206  Rating: 16V  [CAPC1005X60L]  (hidden comment: 0.1uF)
C207  Rating: 16V  [CAPC1005X60L]  (hidden comment: 0.1uF)
C208  Rating: 6.3V  [CAPC1005X55L]  (hidden comment: 0.47uF)
C209  Rating: 6.3V  [CAPC1005X55L]  (hidden comment: 0.47uF)
C210  Rating: 6.3V  [CAPC1005X55L]  (hidden comment: 0.47uF)
C211  Rating: 16V  [CAPC1005X60L]  (hidden comment: 0.1uF)
C212  Rating: 16V  [CAPC1005X60L]  (hidden comment: 0.1uF)
C213  Rating: 16V  [CAPC1005X60L]  (hidden comment: 0.1uF)
C214  Rating: 16V  [CAPC1005X60L]  (hidden comment: 0.1uF)
C215  Rating: 16V  [CAPC1005X60L]  (hidden comment: 0.1uF)
C216  Rating: 25V  [CAPC2012X127L]  (hidden comment: 4.7uF)
C217  Rating: 25V  [CAPC3225X200L]  (hidden comment: 10uF)
C218  Rating: 50V  [CAPC1005X55L]  (hidden comment: 1000pF)
C219  Rating: 16V  [CAPC1005X60L]  (hidden comment: 0.1uF)
C220  Rating: 25V  [CAPC3225X200L]  (hidden comment: 10uF)
C221  Rating: 25V  [CAPC3225X200L]  (hidden comment: 10uF)
L20  Rating: 200mA  [INDC2012X130L]  (hidden comment: 600R)
R151  3R3  [RESC1005X40L]
R152  3R3  [RESC1005X40L]
R153  3R3  [RESC1005X40L]
R154  3R3  [RESC1005X40L]
R155  3R3  [RESC1005X40L]
R156  3R3  [RESC1005X40L]
R157  3R3  [RESC1005X40L]
R158  3R3  [RESC1005X40L]
R159  3R3  [RESC1005X40L]
R160  3R3  [RESC1005X40L]
R161  3R3  [RESC1005X40L]
R162  3R3  [RESC1005X40L]
R163  3R3  [RESC1005X40L]
R164  3R3  [RESC1005X40L]
R165  3R3  [RESC1005X40L]
R166  3R3  [RESC1005X40L]
R167  3R3  [RESC1005X40L]
R168  3R3  [RESC1005X40L]
R169  3R3  [RESC1005X40L]
R170  3R3  [RESC1005X40L]
R171  10K  [RESC1005X40L]
R172  10K  [RESC1005X40L]
R173  0R  [RESC1005X40L]
R174  Tolerance: 1%  [RESC1005X40L]  (hidden comment: 100R)
R175  0R  [RESC1005X40L]
R176  10K  [RESC1005X40L]
R177  Tolerance: 1%  [RESC1005X40L]  (hidden comment: 100R)
R178  Tolerance: 1%  [RESC1005X40L]  (hidden comment: 100R)
R179  Tolerance: 1%  [RESC1005X40L]  (hidden comment: 100R)
R180  Tolerance: 1%  [RESC1005X40L]  (hidden comment: 100R)
R181  10K  [RESC1005X40L]
R182  10K  [RESC1005X40L]
R183  10K  [RESC1005X40L]
R184  10K  [RESC1005X40L]
R185  10K  [RESC1005X40L]
R186  10K  [RESC1005X40L]
R187  10K  [RESC1005X40L]
R188  10K  [RESC1005X40L]
R189  10K  [RESC1005X40L]
R190  Tolerance: 1%  [RESC1005X40L]  (hidden comment: 100R)
R191  10K  [RESC1005X40L]
R285  3R3  [RESC1005X40L]
R286  3R3  [RESC1005X40L]
R287  3R3  [RESC1005X40L]
RP1  49R9  [RESCAV50P100X200X45-8L]
RP2  49R9  [RESCAV50P100X200X45-8L]
RP3  49R9  [RESCAV50P100X200X45-8L]
RP4  49R9  [RESCAV50P100X200X45-8L]
RP5  49R9  [RESCAV50P100X200X45-8L]
RP6  49R9  [RESCAV50P100X200X45-8L]
U2  PPC440EPX-NUA667T  [TE-PBGA680]  (part C of 11)
U40  CDCU877  [TQFN-40]
U41  TPS51100DGQ  [MSOP_10-N]

### Ports
DDR2 (harness DDR2)

### Harnesses
DDR2: DQ[63..0], DM[7..0], DQS[7..0], A[13..0], BA[2..0], Sn, CASn, RASn, WEn, ODT, CKE, CLK_P[3..0], CLK_N[3..0]

### Nets
1V8: C199.2 C200.2 C201.2 C211.2 C217.2 L20.1 R171.2 R172.2 R176.2 R181.2 R182.2 R183.2 R184.2 R185.2 R186.2 R187.2 R188.2 U40.1(VDDQ1) U40.6(VDDQ2) U40.9(VDDQ3) U40.15(VDDQ4) U40.20(VDDQ5) U40.21(OS) U40.23(VDDQ6) U40.28(VDDQ7) U40.31(VDDQ8) U40.36(VDDQ9) U41.1(VDDQSNS) U41.2(VLDOIN)
5V: C216.2 R189.2 R191.2 U41.10(VIN)
DDR2_VREF: C211.1 C212.2 C213.2 C214.2 C215.2 C219.2 U2.AF4(SVREF2A) U2.AL10(SVREF1B) U2.AL19(SVREF2B) U2.Y4(SVREF1A) U41.6(VTTREF)
DDR2_VTT: C202.2 C203.2 C204.2 C208.2 C209.2 C210.2 C220.2 C221.2 R190.1 RP1.5 RP1.6 RP1.7 RP1.8 RP2.5 RP2.6 RP2.7 RP2.8 RP3.5 RP3.6 RP3.7 RP3.8 RP4.5 RP4.6 RP4.7 RP4.8 RP5.5 RP5.6 RP5.7 RP5.8 RP6.5 RP6.6 RP6.7 RP6.8 U41.3(VTT)
GND: C199.1 C200.1 C201.1 C202.1 C203.1 C204.1 C205.1 C206.1 C207.1 C208.1 C209.1 C210.1 C212.1 C213.1 C214.1 C215.1 C216.1 C217.1 C218.1 C219.1 C220.1 C221.1 U40.7(AGND) U40.10(GND1) U40.41(GND2) U41.4(PGND) U41.8(GND) U41.11(PPAD)
DDR2.A0: R151.2 RP6.1
DDR2.A1: R152.2 RP4.1
DDR2.A2: R153.2 RP3.3
DDR2.A3: R154.2 RP4.2
DDR2.A4: R155.2 RP3.1
DDR2.A5: R156.2 RP3.2
DDR2.A6: R157.2 RP3.4
DDR2.A7: R158.2 RP2.1
DDR2.A8: R159.2 RP2.4
DDR2.A9: R160.2 RP2.2
DDR2.A10: R161.2 RP5.3
DDR2.A11: R162.2 RP1.2
DDR2.A12: R163.2 RP1.3
DDR2.A13: R164.2 RP4.3
DDR2.BA0: R165.2 RP5.2
DDR2.BA1: R166.2 RP5.1
DDR2.BA2: R167.2 RP1.4
DDR2.CASn: R169.2 RP4.4 ; port DDR2.CASn
DDR2.CKE: R287.2 RP2.3 ; port DDR2.CKE
DDR2.CLK_N0: R177.2 U40.40(Y1#)
DDR2.CLK_N1: R178.2 U40.30(Y7#)
DDR2.CLK_N2: R179.2 U40.18(Y8#)
DDR2.CLK_N3: R180.2 U40.17(Y9#)
DDR2.CLK_P0: R177.1 U40.39(Y1)
DDR2.CLK_P1: R178.1 U40.29(Y7)
DDR2.CLK_P2: R179.1 U40.19(Y8)
DDR2.CLK_P3: R180.1 U40.16(Y9)
DDR2.CLKOUT_N: R175.1 U2.AK1(MEMCLKOUT#)
DDR2.CLKOUT_P: R173.1 U2.AL1(MEMCLKOUT)
DDR2.CLKOUTR_N: R174.1 R175.2 U40.5(CLK#)
DDR2.CLKOUTR_P: R173.2 R174.2 U40.4(CLK)
DDR2.DM0: U2.AL21(DM0)
DDR2.DM1: U2.AM18(DM1)
DDR2.DM2: U2.AP15(DM2)
DDR2.DM3: U2.AL14(DM3)
DDR2.DM4: U2.AE4(DM4)
DDR2.DM5: U2.AB3(DM5)
DDR2.DM6: U2.Y1(DM6)
DDR2.DM7: U2.U3(DM7)
DDR2.DQ0: U2.AN22(MEMDATA00)
DDR2.DQ1: U2.AP22(MEMDATA01)
DDR2.DQ2: U2.AM20(MEMDATA02)
DDR2.DQ3: U2.AL20(MEMDATA03)
DDR2.DQ4: U2.AL22(MEMDATA04)
DDR2.DQ5: U2.AM22(MEMDATA05)
DDR2.DQ6: U2.AN21(MEMDATA06)
DDR2.DQ7: U2.AP21(MEMDATA07)
DDR2.DQ8: U2.AP20(MEMDATA08)
DDR2.DQ9: U2.AL18(MEMDATA09)
DDR2.DQ10: U2.AN17(MEMDATA10)
DDR2.DQ11: U2.AP17(MEMDATA11)
DDR2.DQ12: U2.AN20(MEMDATA12)
DDR2.DQ13: U2.AP19(MEMDATA13)
DDR2.DQ14: U2.AN18(MEMDATA14)
DDR2.DQ15: U2.AP18(MEMDATA15)
DDR2.DQ16: U2.AM16(MEMDATA16)
DDR2.DQ17: U2.AP16(MEMDATA17)
DDR2.DQ18: U2.AL15(MEMDATA18)
DDR2.DQ19: U2.AP14(MEMDATA19)
DDR2.DQ20: U2.AL17(MEMDATA20)
DDR2.DQ21: U2.AM17(MEMDATA21)
DDR2.DQ22: U2.AN15(MEMDATA22)
DDR2.DQ23: U2.AM15(MEMDATA23)
DDR2.DQ24: U2.AP13(MEMDATA24)
DDR2.DQ25: U2.AN13(MEMDATA25)
DDR2.DQ26: U2.AP12(MEMDATA26)
DDR2.DQ27: U2.AL12(MEMDATA27)
DDR2.DQ28: U2.AM14(MEMDATA28)
DDR2.DQ29: U2.AN14(MEMDATA29)
DDR2.DQ30: U2.AL13(MEMDATA30)
DDR2.DQ31: U2.AM12(MEMDATA31)
DDR2.DQ32: U2.AF3(MEMDATA32)
DDR2.DQ33: U2.AF1(MEMDATA33)
DDR2.DQ34: U2.AD4(MEMDATA34)
DDR2.DQ35: U2.AD3(MEMDATA35)
DDR2.DQ36: U2.AG3(MEMDATA36)
DDR2.DQ37: U2.AF2(MEMDATA37)
DDR2.DQ38: U2.AE2(MEMDATA38)
DDR2.DQ39: U2.AE1(MEMDATA39)
DDR2.DQ40: U2.AC3(MEMDATA40)
DDR2.DQ41: U2.AC1(MEMDATA41)
DDR2.DQ42: U2.AA4(MEMDATA42)
DDR2.DQ43: U2.AA3(MEMDATA43)
DDR2.DQ44: U2.AD2(MEMDATA44)
DDR2.DQ45: U2.AC4(MEMDATA45)
DDR2.DQ46: U2.AB1(MEMDATA46)
DDR2.DQ47: U2.AB2(MEMDATA47)
DDR2.DQ48: U2.Y3(MEMDATA48)
DDR2.DQ49: U2.Y2(MEMDATA49)
DDR2.DQ50: U2.V4(MEMDATA50)
DDR2.DQ51: U2.V3(MEMDATA51)
DDR2.DQ52: U2.AA2(MEMDATA52)
DDR2.DQ53: U2.AA1(MEMDATA53)
DDR2.DQ54: U2.W3(MEMDATA54)
DDR2.DQ55: U2.W1(MEMDATA55)
DDR2.DQ56: U2.U1(MEMDATA56)
DDR2.DQ57: U2.U2(MEMDATA57)
DDR2.DQ58: U2.T4(MEMDATA58)
DDR2.DQ59: U2.R1(MEMDATA59)
DDR2.DQ60: U2.V2(MEMDATA60)
DDR2.DQ61: U2.V1(MEMDATA61)
DDR2.DQ62: U2.T1(MEMDATA62)
DDR2.DQ63: U2.T3(MEMDATA63)
DDR2.DQS0: U2.AM21(DQS0)
DDR2.DQS1: U2.AM19(DQS1)
DDR2.DQS2: U2.AL16(DQS2)
DDR2.DQS3: U2.AM13(DQS3)
DDR2.DQS4: U2.AE3(DQS4)
DDR2.DQS5: U2.AB4(DQS5)
DDR2.DQS6: U2.W4(DQS6)
DDR2.DQS7: U2.U4(DQS7)
DDR2.ODT: R285.2 RP6.2 ; port DDR2.ODT
DDR2.RASn: R168.2 RP5.4 ; port DDR2.RASn
DDR2.Sn: R286.2 RP6.3 ; port DDR2.Sn
DDR2.WEn: R170.2 RP6.4 ; port DDR2.WEn
NetC205_2: C205.2 C206.2 C207.2 L20.2 U40.8(AVDD)
NetC218_2: C218.2 R190.2 U41.5(VTTSNS)
NetR151_1: R151.1 U2.AM5(MEMADDR00)
NetR152_1: R152.1 U2.AP4(MEMADDR01)
NetR153_1: R153.1 U2.AP5(MEMADDR02)
NetR154_1: R154.1 U2.AM6(MEMADDR03)
NetR155_1: R155.1 U2.AP6(MEMADDR04)
NetR156_1: R156.1 U2.AN6(MEMADDR05)
NetR157_1: R157.1 U2.AL7(MEMADDR06)
NetR158_1: R158.1 U2.AN7(MEMADDR07)
NetR159_1: R159.1 U2.AM7(MEMADDR08)
NetR160_1: R160.1 U2.AP7(MEMADDR09)
NetR161_1: R161.1 U2.AL2(MEMADDR10)
NetR162_1: R162.1 U2.AL8(MEMADDR11)
NetR163_1: R163.1 U2.AM8(MEMADDR12)
NetR164_1: R164.1 U2.AG4(MEMADDR13)
NetR165_1: R165.1 U2.AJ3(BA0)
NetR166_1: R166.1 U2.AK3(BA1)
NetR167_1: R167.1 U2.AP8(BA2)
NetR168_1: R168.1 U2.AJ4(RAS#)
NetR169_1: R169.1 U2.AH4(CAS#)
NetR170_1: R170.1 U2.AJ2(WE#)
NetR171_1: R171.1 U40.22(OE)
NetR172_1: R172.1 U2.AN10(DM8)
NetR176_1: R176.1 U2.AP10(DQS8)
NetR181_1: R181.1 U2.AM11(ECC0)
NetR182_1: R182.1 U2.AL11(ECC1)
NetR183_1: R183.1 U2.AM9(ECC2)
NetR184_1: R184.1 U2.AL9(ECC3)
NetR185_1: R185.1 U2.AP11(ECC4)
NetR186_1: R186.1 U2.AN11(ECC5)
NetR187_1: R187.1 U2.AM10(ECC6)
NetR188_1: R188.1 U2.AP9(ECC7)
NetR189_1: R189.1 U41.7(S3)
NetR191_1: R191.1 U41.9(S5)
NetR285_1: R285.1 U2.AH3(MEMODT0)
NetR286_1: R286.1 U2.AH2(BANKSEL#0)
NetR287_1: R287.1 U2.AN9(MEMCLKEN)
NetU40_24: U40.24(FBOUT) U40.27(FBIN)
NetU40_25: U40.25(FBOUT#) U40.26(FBIN#)

Not connected (* = marked no-connect by the designer): RP1 1*; U2 AG1(MEMODT1)* AH1(BANKSEL#1)*; U40 2(Y2#)* 3(Y2)* 11(Y3)* 12(Y3#)* 13(Y4#)* 14(Y4)* 32(Y6#)* 33(Y6)* 34(Y5)* 35(Y5#)* 37(Y0#)* 38(Y0)*

### Buses and harness runs
bus DDR2.A[13..0]
bus DDR2.BA[2..0]
bus DDR2.CLK_N[3..0]
bus DDR2.CLK_P[3..0]
bus DDR2.DM[7..0]
bus DDR2.DQ[63..0]
bus DDR2.DQS[7..0]

### Layout directives
differential pair: (no net found under the mark), DDR2.CLKOUT_N, DDR2.CLKOUT_P, DDR2.CLKOUTR_N, DDR2.CLKOUTR_P

### Notes on the sheet
- (near RP1) PINSWAP: Signals to resistor packs may be swapped
- Note:
  No Termination on FB pair;
  FB Pair MUST be routed as short as possible
- Text
- Route as seperate trace from centre of the VTT island
- (near C215) Place close to SVREF pins
- Place Regulator close to VTT island
- 2009   THIS DOCUMENT IS THE PROPERTY OF THE OWNER, AND MAY NOT BE COPIED OR USED FOR ANY PURPOSE OTHER THAN THAT FOR WHICH IT IS SUPPLIED WITHOUT PERMISSION IN WRITING FROM THE OWNER.
- C
- DATESTAMP OF THIS PRINT
- DRAWN BY:
- DOCUMENT NUMBER:
- SCHEMATIC FILENAME:
- PCB FILENAME:
- ENGINEER:
- APPROVED:
- CIRCUIT DIAGRAM
- DATE
- SHEET
- REVISION
- OF
- (in symbol IC-CPU-1, part C) DDR SDRAM

### Library data of the parts
C199-C201 C206 C207 C211-C215 C219 = CAP-CER-1: as C181 on sheet mgt_breakout; POD number: CAP-CER-1; Value: 0.1uF; RoHS: Y; Sort Value: 0.1; Category: Capacitors; Subcategory: Ceramic
C202-C204 C208-C210 = CAP-CER-7: 0.47uF, Ceramic Capacitor; Manufacturer: MURATA; PartNum: GRM155R60J474KE19; Tolerance: 10%; Dielectric: X5R; POD number: CAP-CER-7; Value: 0.47uF; RoHS: Y; Sort Value: 0.47; Category: Capacitors; Subcategory: Ceramic
C205 C216 = CAP-CER-3: 4.7uF, Ceramic Capacitor; Manufacturer: MURATA; PartNum: GRM21BR61E475KA12K; Tolerance: 10%; Dielectric: X5R; POD number: CAP-CER-3; Value: 4.7uF; RoHS: Y; Sort Value: 4.7; Category: Capacitors; Subcategory: Ceramic
C217 C220 C221 = CAP-CER-5: as C679 on sheet v6_net; POD number: CAP-CER-5; Value: 10uF; RoHS: Y; Sort Value: 100; Category: Capacitors; Subcategory: Ceramic
C218 = CAP-CER-4: as C751 on sheet mgt_breakout; POD number: CAP-CER-4; Value: 1000pF; RoHS: Y; Sort Value: 0.0001; Category: Capacitors; Subcategory: Ceramic
L20 = IND-FB-0: as L25 on sheet mgt_breakout; POD number: IND-FB-0; RoHS: Y; Value: 600R; Sort Value: 600; Category: Inductors; Subcategory: FerriteBead
R151-R170 R285-R287 = RES-TF-24: 3R3, 1.1mm x 0.5mm, Thick Film Resistor; Manufacturer: ROYALOHM; PartNum: 0402WGJ330KT1E; Tolerance: 5%; Rating: 0.0625W; POD number: RES-TF-24; Value: 3R3; Sort Value: 3R3; Category: Resistors; Subcategory: ThickFilm; HelpURL: *.pdf
R171 R172 R176 R181-R189 R191 = RES-TF-5: as R493 on sheet mgt_breakout; POD number: RES-TF-5; Value: 10K; Sort Value: 10000; Category: Resistors; Subcategory: ThickFilm; HelpURL: *.pdf
R173 R175 = RES-TF-0: as R223 on sheet v6_net; POD number: RES-TF-0; Value: 0R; Sort Value: 0; Category: Resistors; Subcategory: ThickFilm; HelpURL: *.pdf
R174 R177-R180 R190 = RES-TF-14: 100R, 1.1mm x 0.5mm, Thick Film Resistor; Manufacturer: ROYALOHM; PartNum: 0402WGF0101T1E; Rating: 0.0625W; POD number: RES-TF-14; Value: 100R; Sort Value: 1000; Category: Resistors; Subcategory: ThickFilm; HelpURL: *.pdf
RP1-RP6 = RES-TF-39: 4-Wide, Isolated, Thick Film Resistor Network; Manufacturer: ROYALOHM; PartNum: 4D02WGJ0510B1E; Tolerance: 1%; Rating: 0.0625W; POD number: RES-TF-39; Value: 49R9; Sort Value: 49.9; Category: Resistors; Subcategory: ThickFilm
U2 = IC-CPU-1: 667MHz, non-RoHS, PPC440EPx uProcessor; Manufacturer: Applied Micro; POD number: IC-CPU-1; PartNum: PPC440EPX-NUA667T; RoHS: Y; Category: IC; Subcategory: CPU
U40 = IC-LOG-15: SSTL Zero-Delay Clock Buffer; Manufacturer: Texas Instruments; POD number: IC-LOG-15; PartNum: CDCU877; RoHS: Y; Category: IC; Subcategory: Logic
U41 = IC-REG-6: 3A Sink/Source Regulator; Manufacturer: Texas Instruments; POD number: IC-REG-6; PartNum: TPS51100DGQ; RoHS: Y; Category: IC; Subcategory: Regulators